# EAGLE design breakout board (EAGLE 9.6.2)
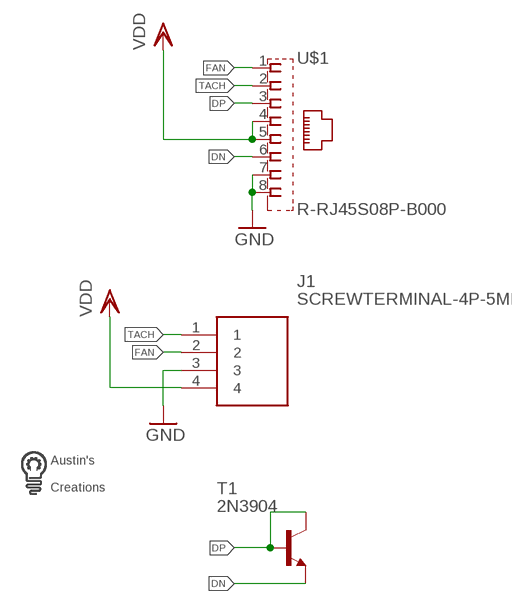
[diagram p0: schematic, sheet 1]

## Parts
J1  SCREWTERMINAL-4P-5MM  [SCREWTERMINAL-4P-5MM]
T1  2N3904  [TO92]
U$1  R-RJ45S08P-B000  [R-RJ45S08P-B000]
U$2  LOGOMED  [LOGOMED]

## Nets
DN: T1.3(E) U$1.6
DP: T1.1(C) T1.2(B) U$1.3
FAN: J1.2 U$1.1
GND: J1.3 U$1.7 U$1.8
TACH: J1.1 U$1.2
VDD: J1.4 U$1.4 U$1.5

## Library data of the parts
J1 = SamacSys_Parts:SCREWTERMINAL-4P-5MM: Fixed Terminal Blocks Terminal block, screw type, 5.00, horizontal, 4 poles, CUI Blue, slotted screw, PCB mount Source: Datasheet <https://componentsearchengine.com/Datasheets/1/TB001-500-04BE.pdf>; DESCRIPTION: Fixed Terminal Blocks Terminal block, screw type, 5.00, horizontal, 4 poles, CUI Blue, slotted screw, PCB mount; HEIGHT: 12.9mm; MANUFACTURER_NAME: CUI Inc.; MANUFACTURER_PART_NUMBER: TB001-500-04BE; MOUSER_PART_NUMBER: 490-TB001-500-04BE; MOUSER_PRICE-STOCK: https://www.mouser.co.uk/ProductDetail/CUI-Devices/TB001-500-04BE?qs=vLWxofP3U2xFd1xqNcHXZA%3D%3D
T1 = transistor:2N3904: NPN TRANSISTOR
U$1 = SamacSys_Parts:R-RJ45S08P-B000
U$2 = custom parts:LOGOMED

## Board
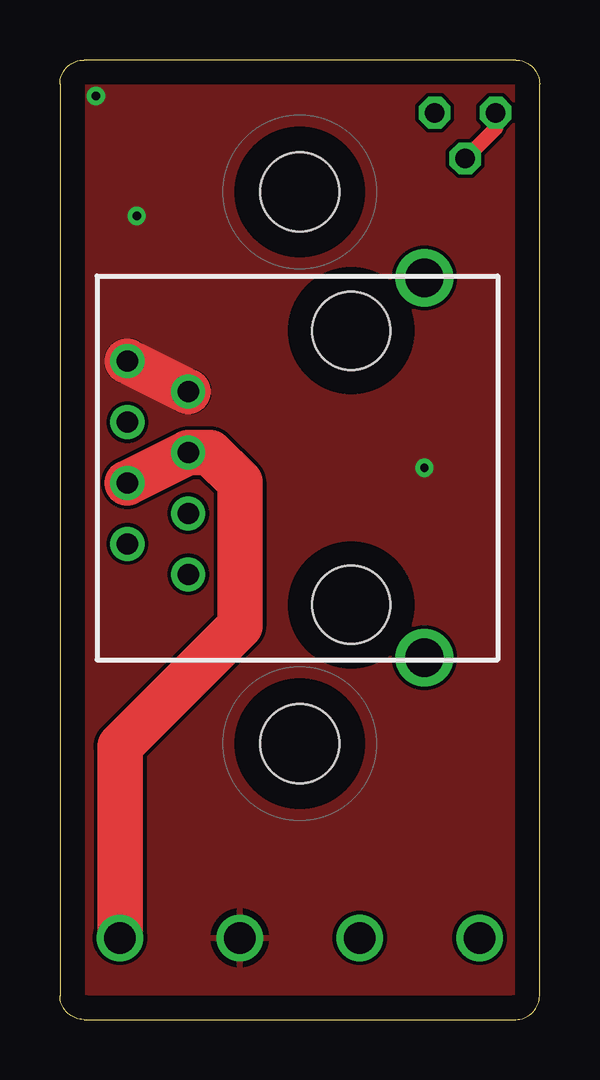
[diagram p1: board, top side]
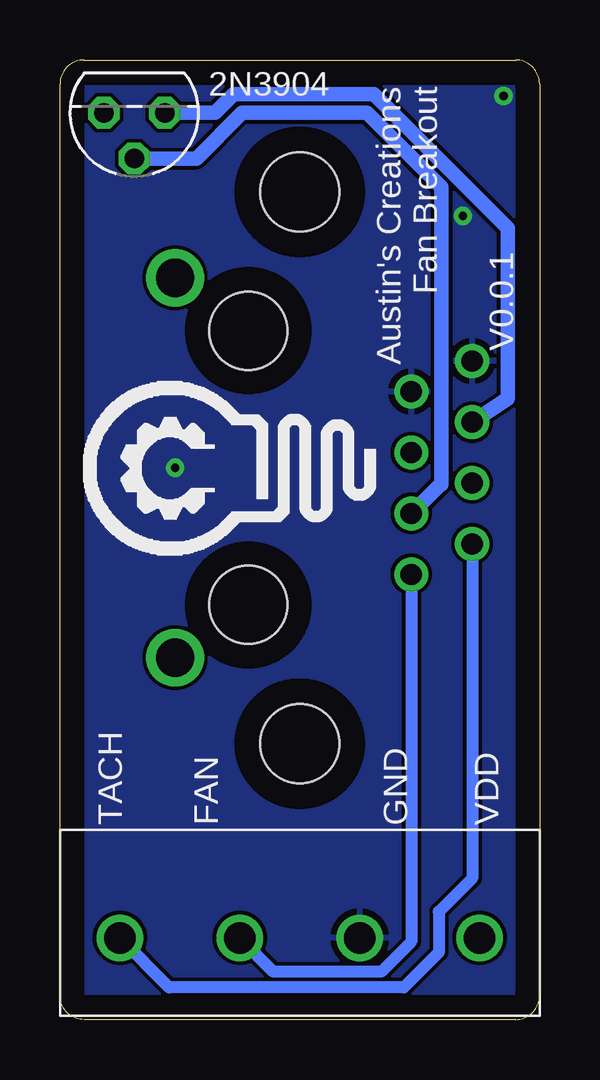
[diagram p2: board, bottom side, seen from below]

Size 20 x 40 mm. Coordinates in mm from the lower left corner, seen from the top.
Outline: 1,0 19,0 arc90 20,1 20,39 arc90 19,40 1,40 arc90 0,39 0,1 arc90 1,0
Copper layers (1*16): Top 0.035mm / dielectric 1.5mm / Bottom 0.035mm
Design rules "default *": minimum track width 6mil, minimum drill 0.35mm, track to track 6mil, track to pad 6mil, pad to pad 6mil, via to via 6mil, smd to smd 6mil, copper to edge 40mil, drill to drill 6mil, minimum pad ring 10mil, minimum via ring 8mil, stop-mask expansion 4mil, vias tented up to drill 0.5mm, thermal gap 10mil
Holes 3.3 mm at 10,34.5 10,11.5
tRestrict: area 7.3,31.8 to 12.7,37.2; area 7.3,8.8 to 12.7,14.2
bRestrict: area 7.3,31.8 to 12.7,37.2; area 7.3,8.8 to 12.7,14.2

### Footprints (pad centres in the part's own frame; a part is rotated, then mirrored left to right if it is on the bottom)
SCREWTERMINAL-4P-5MM = drill 1.3 pad 1.95: 1 0,0; 2 5,0; 3 10,0; 4 15,0
TO92 = drill 0.813 octagon: 1 1.27,0; 2 0,1.905; 3 -1.27,0
R-RJ45S08P-B000 = drill 0.889 pad 1.422: 1 4.445,-9.85; 2 3.175,-12.39; 3 1.905,-9.85; 4 0.635,-12.39; 5 -0.635,-9.85; 6 -1.905,-12.39; 7 -3.175,-9.85; 8 -4.445,-12.39 | drill 1.6 pad 2.184: MH1 -7.915,0; MH2 7.915,0 | hole 3.251: -5.715,-3.05; 5.715,-3.05

### Placement (x,y rotation side)
J1  17.5,3.4 0 bottom
T1  16.9,37.8 180 bottom
U$1  15.2,23 270 top
U$2  6.5,18.7 90 bottom

### Tracks (layer width: path | path; a pad name or v marks a point on that pad's centre or on a via)
DN
  Bottom 0.61: U$1.6 1.32,25.89 1.32,33 6.9,38.58 12.75,38.58 13.53,37.8 T1.3
DP
  Top 0.61: T1.2 18.17,37.16 T1.1
  Bottom 0.61: T1.2 14.3,35.9 12.4,37.8 7.2,37.8 4.1,34.7 4.1,22.3 4.2,22.25 U$1.3
FAN
  Bottom 0.508: U$1.1 5.35,3.25 6.6,2 11.1,2 J1.2
GND  (via drill 0.35)
  Top 1.905: U$1.8 U$1.7
  other vias: 1.5,38.5 15.2,23 3.2,33.5
  pour Top: 0,0 0,40 20,40 20,0
  pour Bottom: 0,0 20,0 20,40 0,40
TACH
  Bottom 0.508: U$1.2 2.81,5.89 4.2,4.5 4.2,2.8 5.66,1.34 15.44,1.34 J1.1
VDD
  Top 1.905: U$1.4 U$1.5 6.26,23.64 7.5,22.4 7.5,16.4 2.5,11.4 J1.4

### Text on the board
bPlace: Austin's Creations / Fan Breakout | 2N3904 | V0.0.1 | VDD | GND | FAN | TACH